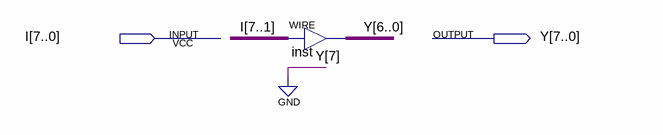
[diagram p0: schematic sheet]
// Quartus schematic SHIFTR1bit.bdf as structural Verilog: 1 symbols, 2 pins
module SHIFTR1bit (
  input  [7:0] I,
  output [7:0] Y
);

  assign Y[6:0] = I[7:1];  // WIRE inst

  assign Y[7] = 1'b0;
endmodule
